# EAGLE design Sensor Node (EAGLE 7.7.0)
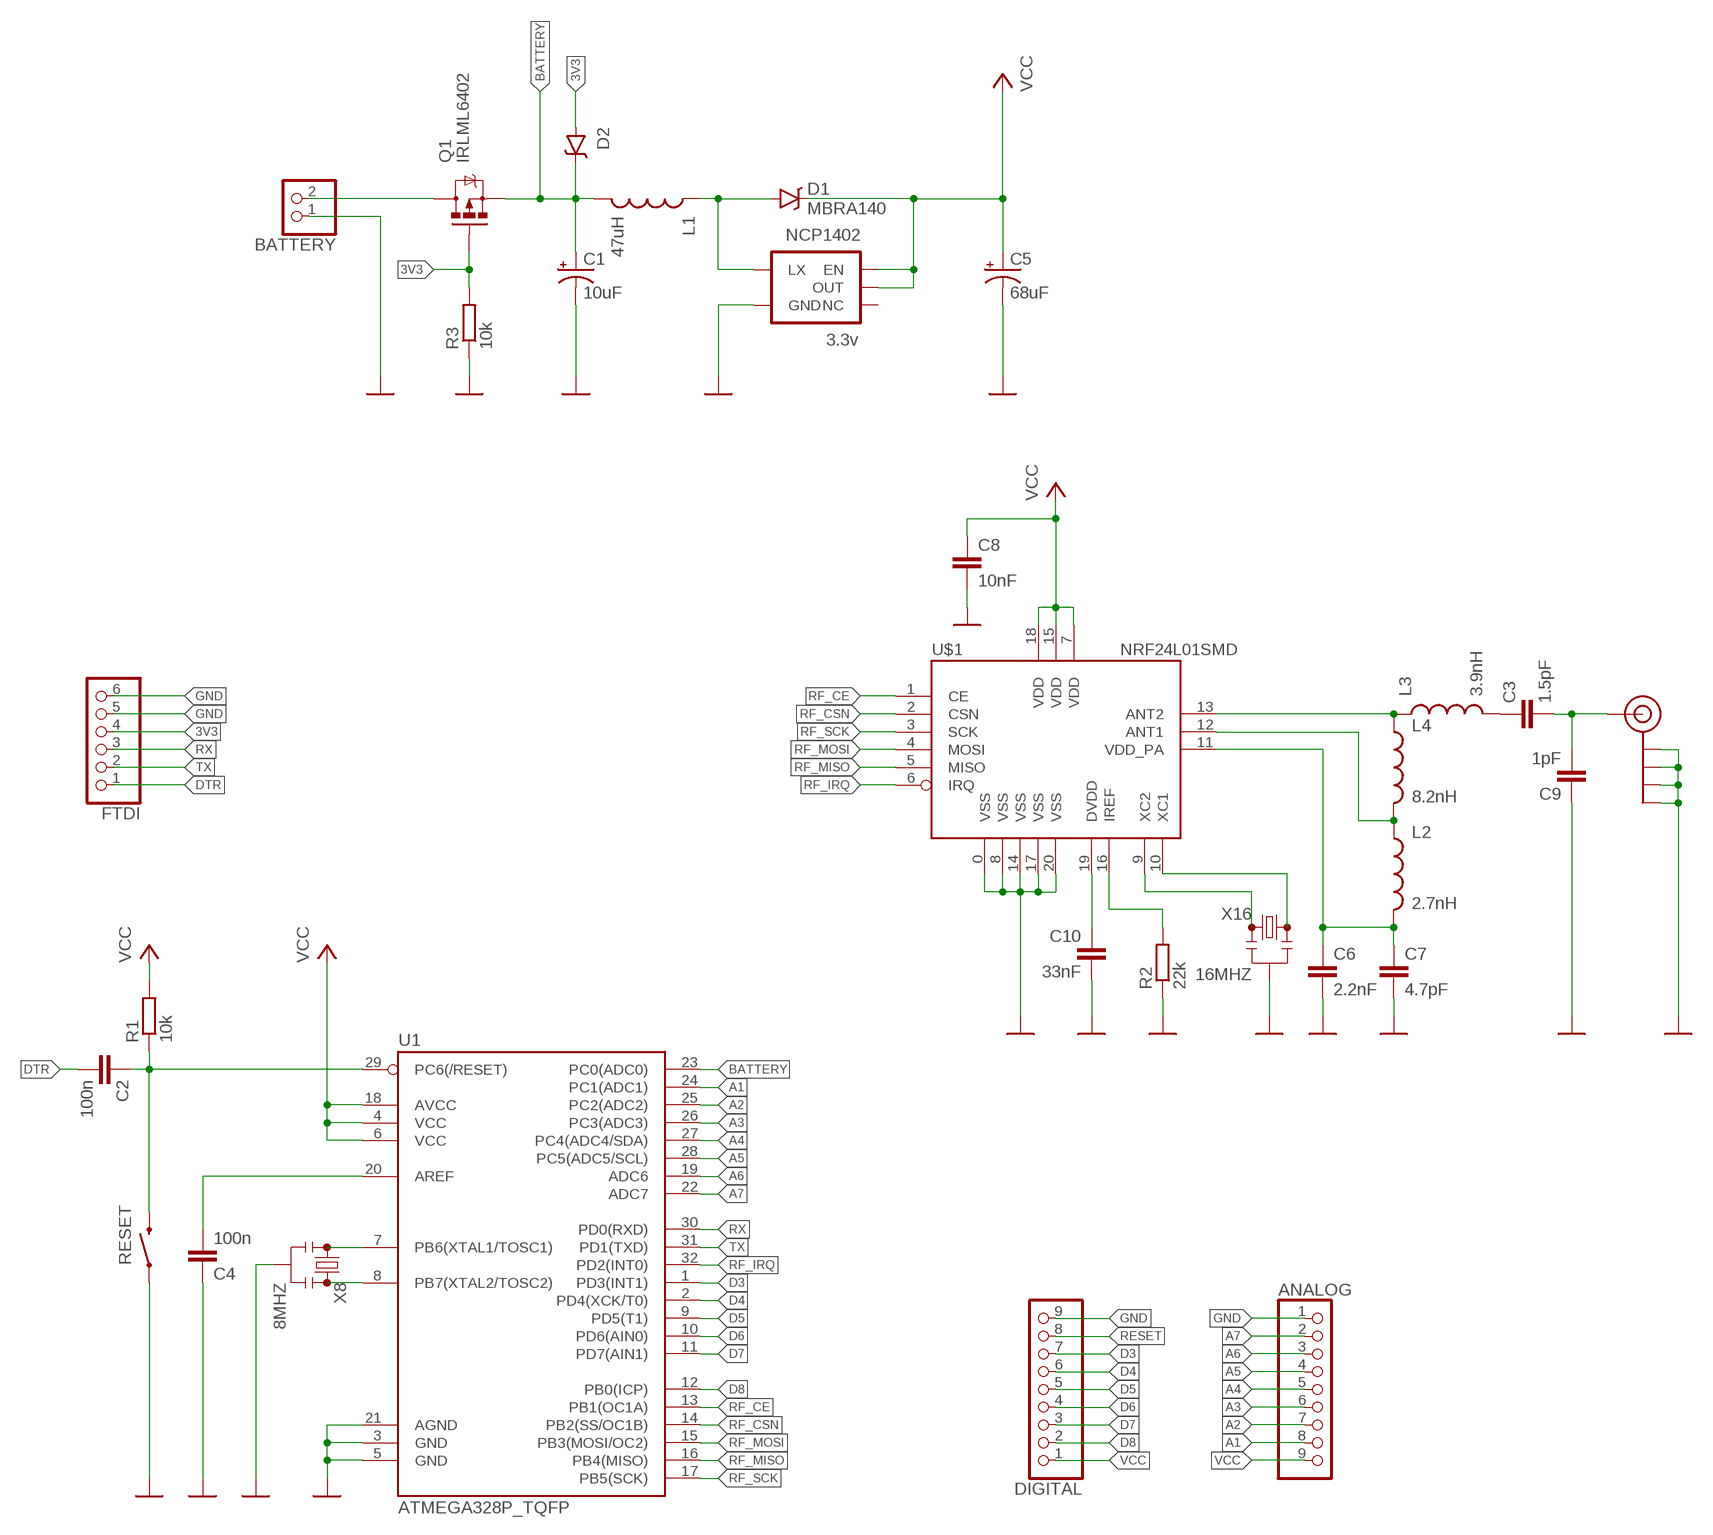
[diagram p0: schematic, sheet 1]

## Parts
ANALOG  PINHD-1X9  [1X09]
BATTERY  PINHD-1X2  [1X02]
C1  10uF  CAP_POL1206-KIT  [EIA3216-KIT]
C2  100n  C-EUC0402  [C0402]
C3  1.5pF  C-EUC0402  [C0402]
C4  100n  C-EUC0402  [C0402]
C5  68uF  CAP_POL3528-KIT  [EIA3528-KIT]
C6  2.2nF  C-EUC0402  [C0402]
C7  4.7pF  C-EUC0402  [C0402]
C8  10nF  C-EUC0402  [C0402]
C9  1pF  C-EUC0402  [C0402]
C10  33nF  C-EUC0402  [C0402]
D1  MBRA140  [SMA-DIODE]
D2  MBRA140  [SMA-DIODE]
DIGITAL  PINHD-1X9  [1X09]
FTDI  PINHD-1X6  [1X06]
J$1  SMA_EDGE  [SMA-EDGE]
L1  47uH  INDUCTORCR54-47UH  [CR54]
L2  2.7nH  INDUCTOR0402  [C0402]
L3  3.9nH  INDUCTOR0402  [C0402]
L4  8.2nH  INDUCTOR0402  [C0402]
NCP1402  3.3v  V_REG_NCP1400_3.3V  [SOT23-5]
Q1  IRLML6402  MOSFET-PCHANNELSMD  [SOT23-3]
R1  10k  R-EU_R0402  [R0402]
R2  22k  R-EU_R0402  [R0402]
R3  10k  R-EU_R0402  [R0402]
RESET  SWITCH-MOMENTARY-2SMD-1101NE  [TACTILE-SWITCH-1101NE]
U1  ATMEGA328P_TQFP  [TQFP32-08]
U$1  NRF24L01SMD  [QFN20]
X8  8MHZ  RESONATOR8MHZ  [RESONATOR-SMD]
X16  16MHZ  RESONATOR16MHZ  [RESONATOR-SMD]

## Nets
3V3 [power]: D2.A FTDI.4 Q1.1(G) R3.2
A1: ANALOG.8 U1.24(PC1(ADC1))
A2: ANALOG.7 U1.25(PC2(ADC2))
A3: ANALOG.6 U1.26(PC3(ADC3))
A4: ANALOG.5 U1.27(PC4(ADC4/SDA))
A5: ANALOG.4 U1.28(PC5(ADC5/SCL))
A6: ANALOG.3 U1.19(ADC6)
A7: ANALOG.2 U1.22(ADC7)
BAT+: BATTERY.2 Q1.3(D)
BATTERY: C1.A(+) D2.C L1.P$2 Q1.2(S) U1.23(PC0(ADC0))
D3: DIGITAL.7 U1.1(PD3(INT1))
D4: DIGITAL.6 U1.2(PD4(XCK/T0))
D5: DIGITAL.5 U1.9(PD5(T1))
D6: DIGITAL.4 U1.10(PD6(AIN0))
D7: DIGITAL.3 U1.11(PD7(AIN1))
D8: DIGITAL.2 U1.12(PB0(ICP))
DTR: C2.2 FTDI.1
GND [power]: ANALOG.1 BATTERY.1 C1.C(-) C4.1 C5.C(-) C6.2 C7.2 C8.2 C9.1 C10.2 DIGITAL.9 FTDI.5 FTDI.6 J$1.GND@0(GND) J$1.GND@1(GND) J$1.GND@2(GND) J$1.GND@3(GND) NCP1402.4(GND) R2.1 R3.1 RESET.1 U1.3(GND) U1.5(GND) U1.21(AGND) U$1.0(VSS) U$1.8(VSS) U$1.14(VSS) U$1.17(VSS) U$1.20(VSS) X8.2 X16.2
N$1: D1.A L1.P$1 NCP1402.5(LX)
N$3: C3.1 L3.2
N$4: C4.2 U1.20(AREF)
N$6: L3.1 L4.1 U$1.13(ANT2)
N$8: U1.7(PB6(XTAL1/TOSC1)) X8.1
N$9: U1.8(PB7(XTAL2/TOSC2)) X8.3
N$10: L2.1 L4.2 U$1.12(ANT1)
N$11: R2.2 U$1.16(IREF)
N$12: C3.2 C9.2 J$1.SIG(SIGNAL)
N$13: C10.1 U$1.19(DVDD)
N$14: C6.1 C7.1 L2.2 U$1.11(VDD_PA)
N$15: U$1.9(XC2) X16.3
N$16: U$1.10(XC1) X16.1
RESET: C2.1 DIGITAL.8 R1.1 RESET.2 U1.29(PC6(/RESET))
RF_CE: U1.13(PB1(OC1A)) U$1.1(CE)
RF_CSN: U1.14(PB2(SS/OC1B)) U$1.2(CSN)
RF_IRQ: U1.32(PD2(INT0)) U$1.6(IRQ)
RF_MISO: U1.16(PB4(MISO)) U$1.5(MISO)
RF_MOSI: U1.15(PB3(MOSI/OC2)) U$1.4(MOSI)
RF_SCK: U1.17(PB5(SCK)) U$1.3(SCK)
RX: FTDI.3 U1.30(PD0(RXD))
TX: FTDI.2 U1.31(PD1(TXD))
VCC [power]: ANALOG.9 C5.A(+) C8.1 D1.C DIGITAL.1 NCP1402.1(EN) NCP1402.2(OUT) R1.2 U1.4(VCC) U1.6(VCC) U1.18(AVCC) U$1.7(VDD) U$1.15(VDD) U$1.18(VDD)
Unconnected: NCP1402.3(NC)

## Library data of the parts
ANALOG DIGITAL = pinhead:PINHD-1X9: PIN HEADER
BATTERY = pinhead:PINHD-1X2: PIN HEADER
C1 C5 = SparkFun-Passives:CAP_POL: Capacitor Polarized These are standard SMD and PTH capacitors. Normally 10uF, 47uF, and 100uF in electrolytic and tantalum varieties. Always verify the external diameter of the through hole cap, it varies with capacity, voltage, and manufacturer. The EIA devices should be standard.
C2-C4 C6-C10 = rcl:C-EU: CAPACITOR, European symbol
D1 D2 = SparkFun-DiscreteSemi:MBRA140: 40V, 1A Schottky rectifier SMA/DO-214AC package DIO-08053; PROD_ID: DIO-08053
FTDI = pinhead:PINHD-1X6: PIN HEADER
J$1 = SparkFun-Connectors:SMA_EDGE: SMA Antenna Connector End launch SMA connector. The paste layer has been removed so that the connector can be hand soldered onto the board after reflow.
L1 = SparkFun-Passives:INDUCTOR: Inductors Basic Inductor/Choke - 0603 and 1206. Footprints are not proven and vary greatly between part numbers. INDUCTOR POWER 3.3UH 4.0A SMD 0.197" L x 0.197" W x 0.177" H (5.00mm x 5.00mm x 4.50mm); PROD_ID: NDUC-10789
L2-L4 = SparkFun-Passives:INDUCTOR: Inductors Basic Inductor/Choke - 0603 and 1206. Footprints are not proven and vary greatly between part numbers. INDUCTOR POWER 3.3UH 4.0A SMD 0.197" L x 0.197" W x 0.177" H (5.00mm x 5.00mm x 4.50mm)
NCP1402 = SparkFun-PowerIC:V_REG_NCP1400: Switching step-up voltage regulator NCP1400 switiching regulator takes single cell AA and outputs 100mA at 3.3V or 5V with minimal number of external components.; PROD_ID: IC-10788
Q1 = User-Submitted:MOSFET-PCHANNEL: Generic PMOSFET IRLML2244 - TRANS-11153 (SOT-23 -20V -4.3A) (1.Gate 2.Source 3.Drain) FQP27P06 - COM-10349 <http://www.sparkfun.com/products/10349> (TO-220 -60V -27A) (1.Gate 2.Source 3.Drain)
R1-R3 = rcl:R-EU_: RESISTOR, European symbol
RESET = SparkFun-Electromechanical:SWITCH-MOMENTARY-2: Various NO switches- pushbuttons, reed, etc; PROD_ID: SWCH-00815
U1 = SparkFun-DigitalIC:ATMEGA328P_TQFP; PROD_ID: IC-09069
U$1 = SparkFun-RF:NRF24L01: 2.4GHz Low Power Transceiver This is the very popular, low cost, very low power RF transceiver from Nordic Semiconductor. Simple SPI interface. SKU: COM-00690
X8 = SparkFun-FreqCtrl:RESONATOR: Resonator Small SMD resonator. Used, eg, on the Arduino Pro/ Pro Mini boards. 8MHz- XTAL-08895 16MHz- XTAL-08900; PROD_ID: XTAL-08895
X16 = SparkFun-FreqCtrl:RESONATOR: Resonator Small SMD resonator. Used, eg, on the Arduino Pro/ Pro Mini boards. 8MHz- XTAL-08895 16MHz- XTAL-08900; PROD_ID: XTAL-08900

## Board
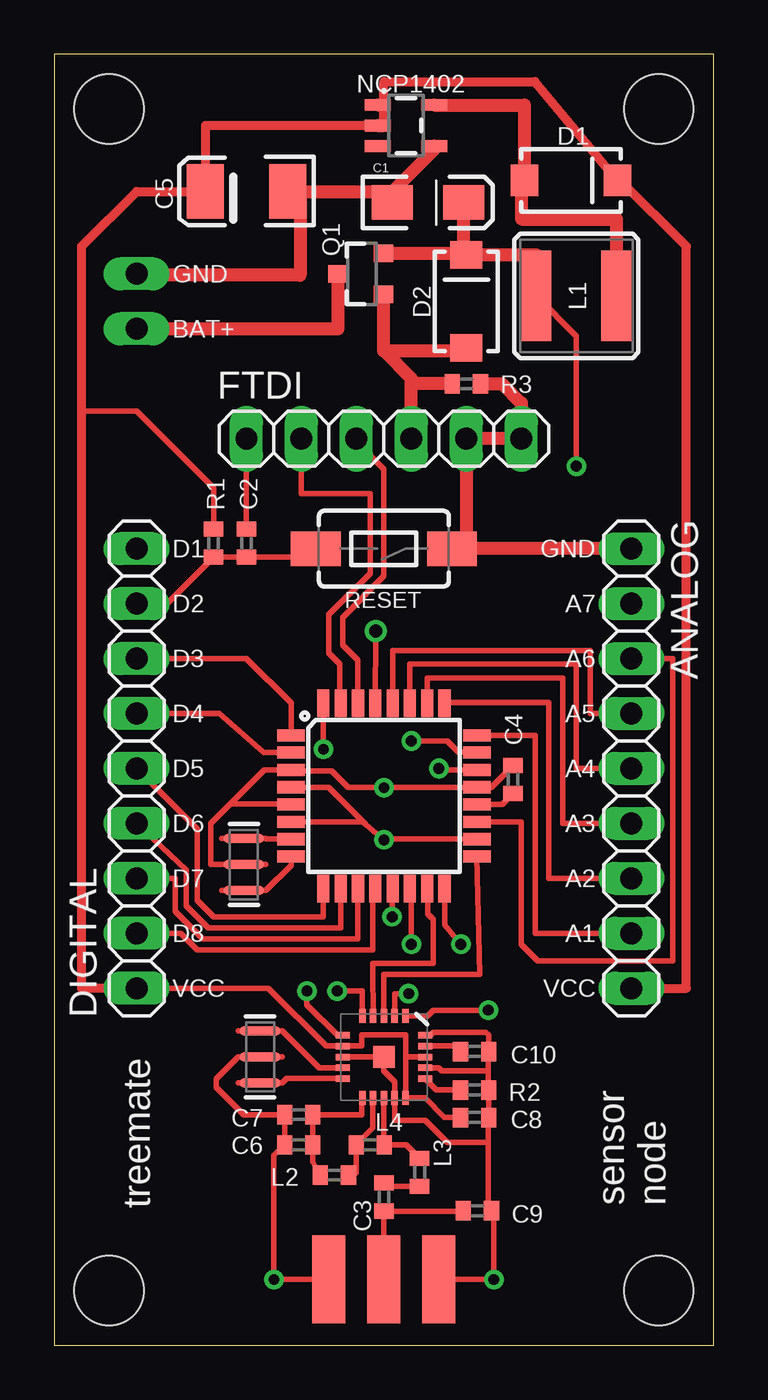
[diagram p1: board, top side]
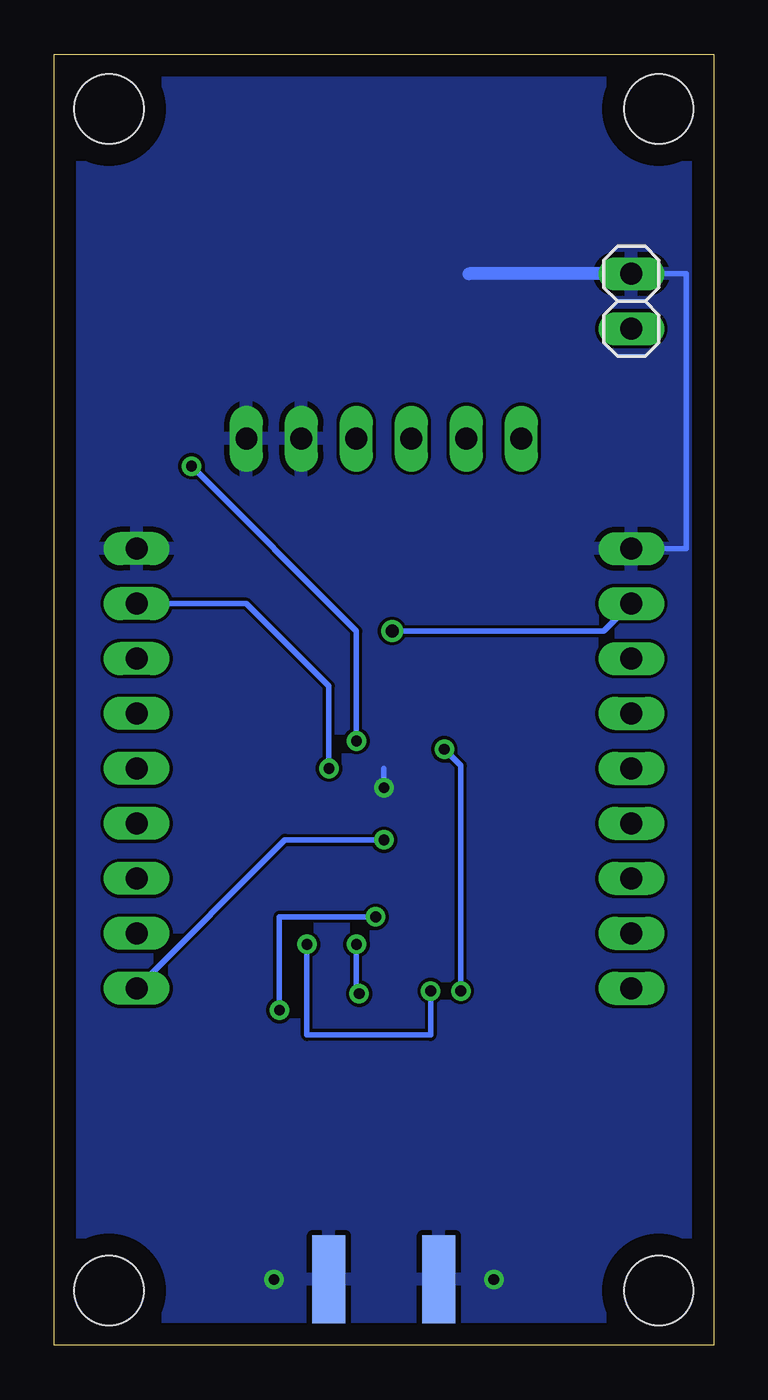
[diagram p2: board, bottom side, seen from below]

Size 30.48 x 59.69 mm. Coordinates in mm from the lower left corner, seen from the top.
Outline: 0,0 30.48,0 30.48,59.69 0,59.69 0,0
Copper layers (1*16): Top 0.035mm / dielectric 1.5mm / Bottom 0.035mm
Design rules "default *": minimum track width 10mil, minimum drill 19mil, track to track 6mil, track to pad 8mil, pad to pad 8mil, via to via 8mil, smd to smd 8mil, copper to edge 40mil, drill to drill 8mil, minimum pad ring 10mil, minimum via ring 8mil, stop-mask expansion 4mil, vias tented up to drill 0mil, thermal gap 10mil
Holes 3.2 mm at 2.54,57.15 27.94,57.15 27.94,2.54 2.54,2.54

### Footprints (pad centres in the part's own frame; a part is rotated, then mirrored left to right if it is on the bottom)
1X09 = drill 1.016 long: 1 -10.16,0; 2 -7.62,0; 3 -5.08,0; 4 -2.54,0; 5 0,0; 6 2.54,0; 7 5.08,0; 8 7.62,0; 9 10.16,0
1X02 = drill 1.016 long: 1 -1.27,0; 2 1.27,0
EIA3216-KIT = smd 1.9 x 1.6: A 1.65,0; C -1.65,0
C0402 = smd 0.7 x 0.9: 1 -0.65,0; 2 0.65,0
EIA3528-KIT = smd 1.7 x 2.5: A 1.9,0; C -1.9,0
SMA-DIODE = smd 1.27 x 1.47: A -2.15,0; C 2.15,0
1X06 = drill 1.016 long: 1 -6.35,0; 2 -3.81,0; 3 -1.27,0; 4 1.27,0; 5 3.81,0; 6 6.35,0
SMA-EDGE = smd 1.524 x 4.064: GND@0 0,0; GND@1 5.08,0; SIG 2.54,0 | smd 1.524 x 4.064 bottom: GND@2 0,0; GND@3 5.08,0
CR54 = smd 4.2 x 1.4: P$1 0,1.85; P$2 0,-1.85
SOT23-5 = smd 0.55 x 1.2: 1 -0.95,-1.3; 2 0,-1.3; 3 0.95,-1.3; 4 0.95,1.3; 5 -0.95,1.3
SOT23-3 = smd 0.8 x 0.9: 1 -0.95,-1; 2 0.95,-1; 3 0,1.1
R0402 = smd 0.7 x 0.9: 1 -0.65,0; 2 0.65,0
TACTILE-SWITCH-1101NE = smd 2.3 x 1.6: 1 -3.15,0; 2 3.15,0
TQFP32-08 = smd 1.27 x 0.559: 1 -4.293,2.8; 2 -4.293,2; 3 -4.293,1.2; 4 -4.293,0.4; 5 -4.293,-0.4; 6 -4.293,-1.2; 7 -4.293,-2; 8 -4.293,-2.8; 17 4.293,-2.8; 18 4.293,-2; 19 4.293,-1.2; 20 4.293,-0.4; 21 4.293,0.4; 22 4.293,1.2; 23 4.293,2; 24 4.293,2.8 | smd 0.559 x 1.27: 9 -2.8,-4.293; 10 -2,-4.293; 11 -1.2,-4.293; 12 -0.4,-4.293; 13 0.4,-4.293; 14 1.2,-4.293; 15 2,-4.293; 16 2.8,-4.293; 25 2.8,4.293; 26 2,4.293; 27 1.2,4.293; 28 0.4,4.293; 29 -0.4,4.293; 30 -1.2,4.293; 31 -2,4.293; 32 -2.8,4.293
QFN20 = smd 1 x 1: 0 0,0 | smd 0.65 x 0.3: 1 -1.9,1; 2 -1.9,0.5; 3 -1.9,0; 4 -1.9,-0.5; 5 -1.9,-1; 11 1.9,-1; 12 1.9,-0.5; 13 1.9,0; 14 1.9,0.5; 15 1.9,1 | smd 0.3 x 0.65: 6 -1,-1.9; 7 -0.5,-1.9; 8 0,-1.9; 9 0.5,-1.9; 10 1,-1.9; 16 1,1.9; 17 0.5,1.9; 18 0,1.9; 19 -0.5,1.9; 20 -1,1.9
RESONATOR-SMD = smd 0.45 x 1.905: 1 -1.2,0; 2 0,0; 3 1.2,0

### Placement (x,y rotation side)
ANALOG  26.67,26.67 270 top
BATTERY  3.81,48.26 270 bottom
C1  17.27,52.83 0 top
C2  8.89,37.08 90 top
C3  15.24,6.86 270 top
C4  21.21,26.16 270 top
C5  8.89,53.34 180 top
C6  11.3,9.27 180 top
C7  11.3,10.67 180 top
C8  19.43,10.54 0 top
C9  19.56,6.22 180 top
C10  19.43,13.59 0 top
D1  23.88,53.85 0 top
D2  19.05,48.26 90 top
DIGITAL  3.81,26.67 90 top
FTDI  15.24,41.91 0 top
J$1  17.78,3.05 180 top
L1  24.13,48.51 270 top
L2  12.95,7.87 180 top
L3  16.89,8 270 top
L4  14.61,9.27 180 top
NCP1402  16.26,56.39 270 top
Q1  14.22,49.53 90 top
R1  7.37,37.08 90 top
R2  19.43,11.81 180 top
R3  19.05,44.45 180 top
RESET  15.24,36.83 180 top
U1  15.24,25.4 0 top
U$1  15.24,13.34 270 top
X8  8.76,22.23 270 top
X16  9.53,13.34 90 top

### Tracks (layer width: path | path; a pad name or v marks a point on that pad's centre or on a via)
3V3
  Top 0.61: 15.22,45.97 19.05,45.97 D2.A | 15.22,45.97 Q1.1 | 16.51,44.45 16.51,44.69 15.22,45.97 | R3.2 16.51,44.45 | FTDI.4 16.51,44.45
A1
  Top 0.254: ANALOG.8 22.23,19.05 22.23,28.19 U1.24
A2
  Top 0.254: ANALOG.7 22.86,21.59 22.86,29.72 18.04,29.72 U1.25
A3
  Top 0.254: ANALOG.6 23.5,24.13 23.5,30.86 17.24,30.86 U1.26
A4
  Top 0.254: ANALOG.5 24.13,26.67 24.13,31.5 16.44,31.5 U1.27
A5
  Top 0.254: ANALOG.4 24.77,29.21 24.77,32.13 15.64,32.13 U1.28
A6
  Top 0.254: U1.19 21.59,24.2 21.59,18.54 22.35,17.78 28.57,17.78 28.57,31.75 ANALOG.3
A7  (via drill 0.5)
  Top 0.254: U1.22 17.85,26.6 v17.78,26.67
  Bottom 0.254: ANALOG.2 21.59,34.29 17.78,30.48 v17.78,26.67
BAT+
  Top 0.61: BATTERY.2 13.12,46.99 Q1.3
BATTERY  (via drill 0.5)
  Top 0.254: 21.59,50.16 L1.P$2 24.13,46.66 v24.13,40.64 | U1.23 19.5,27.43 18.67,27.43 18.16,27.94 v16.51,27.94
  Top 0.61: Q1.2 19.05,50.48 D2.C | D2.C 18.92,50.41 C1.A | D2.C 22.28,50.41 L1.P$2
  Bottom 0.254: v16.51,27.94 16.51,33.02 v24.13,40.64
D3
  Top 0.254: U1.1 10.95,29.69 8.89,31.75 DIGITAL.7
D4
  Top 0.254: U1.2 9.68,27.4 7.62,29.21 DIGITAL.6
D5
  Top 0.254: U1.9 12.44,19.82 12.45,19.81 7.37,19.81 6.6,20.57 6.6,23.88 DIGITAL.5
D6
  Top 0.254: DIGITAL.4 6.1,21.97 6.1,20.32 7.11,19.3 13.24,19.3 U1.10
D7
  Top 0.254: DIGITAL.3 5.59,21.59 5.59,20.07 6.86,18.8 14.04,18.8 U1.11
D8
  Top 0.254: DIGITAL.2 5.84,19.05 6.6,18.29 14.71,18.29 14.71,20.98 U1.12
DTR
  Top 0.254: FTDI.1 C2.2
GND  (via drill 0.5)
  Top 0.254: U1.21 20.2,25.8 C4.1 | U$1.8 U$1.0 15.24,12.7 15.75,12.19 U$1.14 15.74,10.42 15.75,10.41 17.14,10.41 18.16,9.4 20.07,9.4 | U$1.20 17.16,14.35 17.4,14.35 17.53,14.48 19.95,14.48 20.08,14.35 C10.2 20.07,13.57 20.07,12.7 | 9.78,22.23 7.24,22.23 7.24,24.13 8.13,25.02 | 8.13,25.02 10.93,25.02 U1.5 | 19.51,25.78 U1.21 | 8.13,25.02 9.71,26.6 U1.3 11,26.54 12.83,26.54 13.59,25.78 v15.24,25.78 U1.21 | J$1.GND@3 v10.16,3.05 10.16,8.78 C6.2 C7.2 8.76,10.67 7.49,11.94 7.49,12.32 8.51,13.34 | 20.32,5.98 C9.1 20.07,6.37 20.07,9.4 | U$1.17 17.77,12.84 17.91,12.7 20.07,12.7 | 20.07,12.7 20.07,11.83 R2.1 C8.2 20.07,10.53 20.07,9.4 | J$1.GND@2 v20.32,3.05 20.32,5.98 | 20.08,5.98 20.32,5.98
  Top 0.61: 15.62,53.34 C5.C 11.37,53.34 11.37,49.47 3.81,49.47 BATTERY.1 | 15.62,53.34 C1.C | 15.62,53.34 17.56,55.27 NCP1402.4 | R3.1 20.7,44.45 21.59,43.56 FTDI.6 FTDI.5 19.05,36.83 | ANALOG.1 19.05,36.83 | 19.05,36.83 RESET.1
  Bottom 0.254: DIGITAL.9 1.27,36.83 1.27,49.53 BATTERY.1 | v15.24,25.78 15.24,26.67
  Bottom 0.61: BATTERY.1 11.3,49.53
  pour Bottom: 0,0 30.48,0 30.48,59.69 0,59.69 0,58.42
N$1
  Top 0.61: L1.P$1 25.98,52.07 21.59,52.07 21.59,53.85 D1.A 21.73,57.34 NCP1402.5
N$3
  Top 0.254: L3.2 15.4,7.35 C3.1
N$4
  Top 0.254: U1.20 20.7,25 C4.2
N$6
  Top 0.254: U$1.13 15.24,9.29 L4.1 16.27,9.27 L3.1
N$8
  Top 0.254: U1.7 9.8,23.4 9.78,23.43
N$9
  Top 0.254: U1.8 10.95,22.19 9.78,21.02
N$10
  Top 0.254: U$1.12 14.73,10.05 L4.2 13.96,7.97 L2.1
N$11
  Top 0.254: U$1.16 17.14,12.32 17.65,11.81 R2.2
N$12
  Top 0.254: 15.26,2.56 J$1.SIG C3.2 18.65,6.21 C9.2
N$13
  Top 0.254: U$1.19 18.54,13.84 C10.1
N$14
  Top 0.254: U$1.11 14.22,11.44 14.22,10.67 C7.1 C6.1 11.95,8.48 L2.2
N$15
  Top 0.254: U$1.9 12.24,12.84 10.54,14.54
N$16
  Top 0.254: U$1.10 10.74,12.34 10.54,12.13
RESET  (via drill 0.6)
  Top 0.254: DIGITAL.8 5.22,34.29 R1.1 C2.1 12.09,36.43 RESET.2 | U1.29 v14.86,33.02
  Bottom 0.254: v14.86,33.02 5.08,33.02 DIGITAL.8
RF_CE  (via drill 0.5)
  Top 0.254: U1.13 15.62,21.11 v15.62,19.81 | U$1.1 17.27,15.24 17.53,15.49 v20.07,15.49
  Bottom 0.254: v20.07,15.49 20.07,19.81 v15.62,19.81
RF_CSN  (via drill 0.5)
  Top 0.254: U$1.2 15.75,16.26 v16.38,16.26 | U1.14 16.51,21.11 v16.51,18.54
  Bottom 0.254: 16.38,18.8 v16.51,18.54 16.51,16.26 v16.38,16.26
RF_IRQ  (via drill 0.5)
  Top 0.254: U$1.6 13.1,14.34 11.68,15.75 v11.68,16.38 | v12.45,27.56 U1.32
  Bottom 0.254: v11.68,16.38 11.68,26.8 v12.45,27.56
RF_MISO  (via drill 0.5)
  Top 0.254: U$1.5 14.24,16.38 v13.08,16.38 | v18.8,18.54 18.04,19.43 U1.16
  Bottom 0.254: v13.08,16.38 13.08,14.35 18.8,14.35 v18.8,18.54
RF_MOSI
  Top 0.254: U$1.4 14.73,17.4 14.73,17.65 17.53,17.65 17.53,19.68 17.27,19.94 17.27,21.07 U1.15
RF_SCK
  Top 0.254: U$1.3 15.24,17.14 19.66,17.14 U1.17
RX
  Top 0.254: 14.1,29.69 U1.30 14.04,31.68 13.34,32.38 13.34,33.66 15.24,35.56 15.24,40.51 13.97,41.78 FTDI.3
TX
  Top 0.254: U1.31 13.21,29.73 13.21,31.5 12.7,32 12.7,33.78 14.61,35.69 14.61,39.37 11.43,39.37 FTDI.2
VCC  (via drill 0.5)
  Top 0.254: U$1.18 16.26,13.34 | 16.26,13.34 16.26,11.45 U$1.15 17.14,11.44 18.03,10.54 C8.1 | 16.26,13.34 16.26,14.35 14.22,14.35 14.22,13.84 U$1.7 12.58,13.84 9.91,16.51 DIGITAL.1 | R1.2 7.37,39.62 3.81,43.18 1.27,43.18 | U1.4 12.68,25.8 14.28,24.2 | 19.5,23.37 U1.18 15.27,23.4 v15.24,23.37 | U1.6 14.28,24.2 | 15.14,23.4 v15.24,23.37 | 14.28,24.2 14.41,24.07 v15.24,23.37
  Top 0.406: 15.24,56.39 15.24,57.34 15.24,58.42 22.22,58.42 D1.C 26.16,53.85 29.21,50.8 29.21,16.51 ANALOG.9 | NCP1402.2 6.99,56.39 C5.A 3.81,53.34 1.27,50.8 1.27,43.18 1.27,16.51 DIGITAL.1
  Top 0.61: NCP1402.2 15.24,56.39 | NCP1402.1 15.24,57.34
  Bottom 0.254: ANALOG.9 19.81,23.37 v15.24,23.37

### Text on the board
tNames: GND | BAT+ | D1 | GND | D2 | A7 | D3 | A6 | D4 | A5 | D5 | A4 | D6 | A3 | D7 | A2 | D8 | A1 | VCC | VCC | treemate | sensor / node